# Altium schematic sheet DENAS_Scheme.SchDoc: Название платы
size 840 x 594 mm; ApprovedBy: Рогов; CheckedBy: Фамилия проверяющего; DrawnBy: Фамилия разработчика; DocumentNumber: Введите номер платы + Э3; SheetNumber: пусто если лист 1, иначе 1; SheetTotal: количество листов; Title1str: (вторая строка при необходимости); DocumentType: тип схемы; Format: A1; ImagePath: Введите номер платы
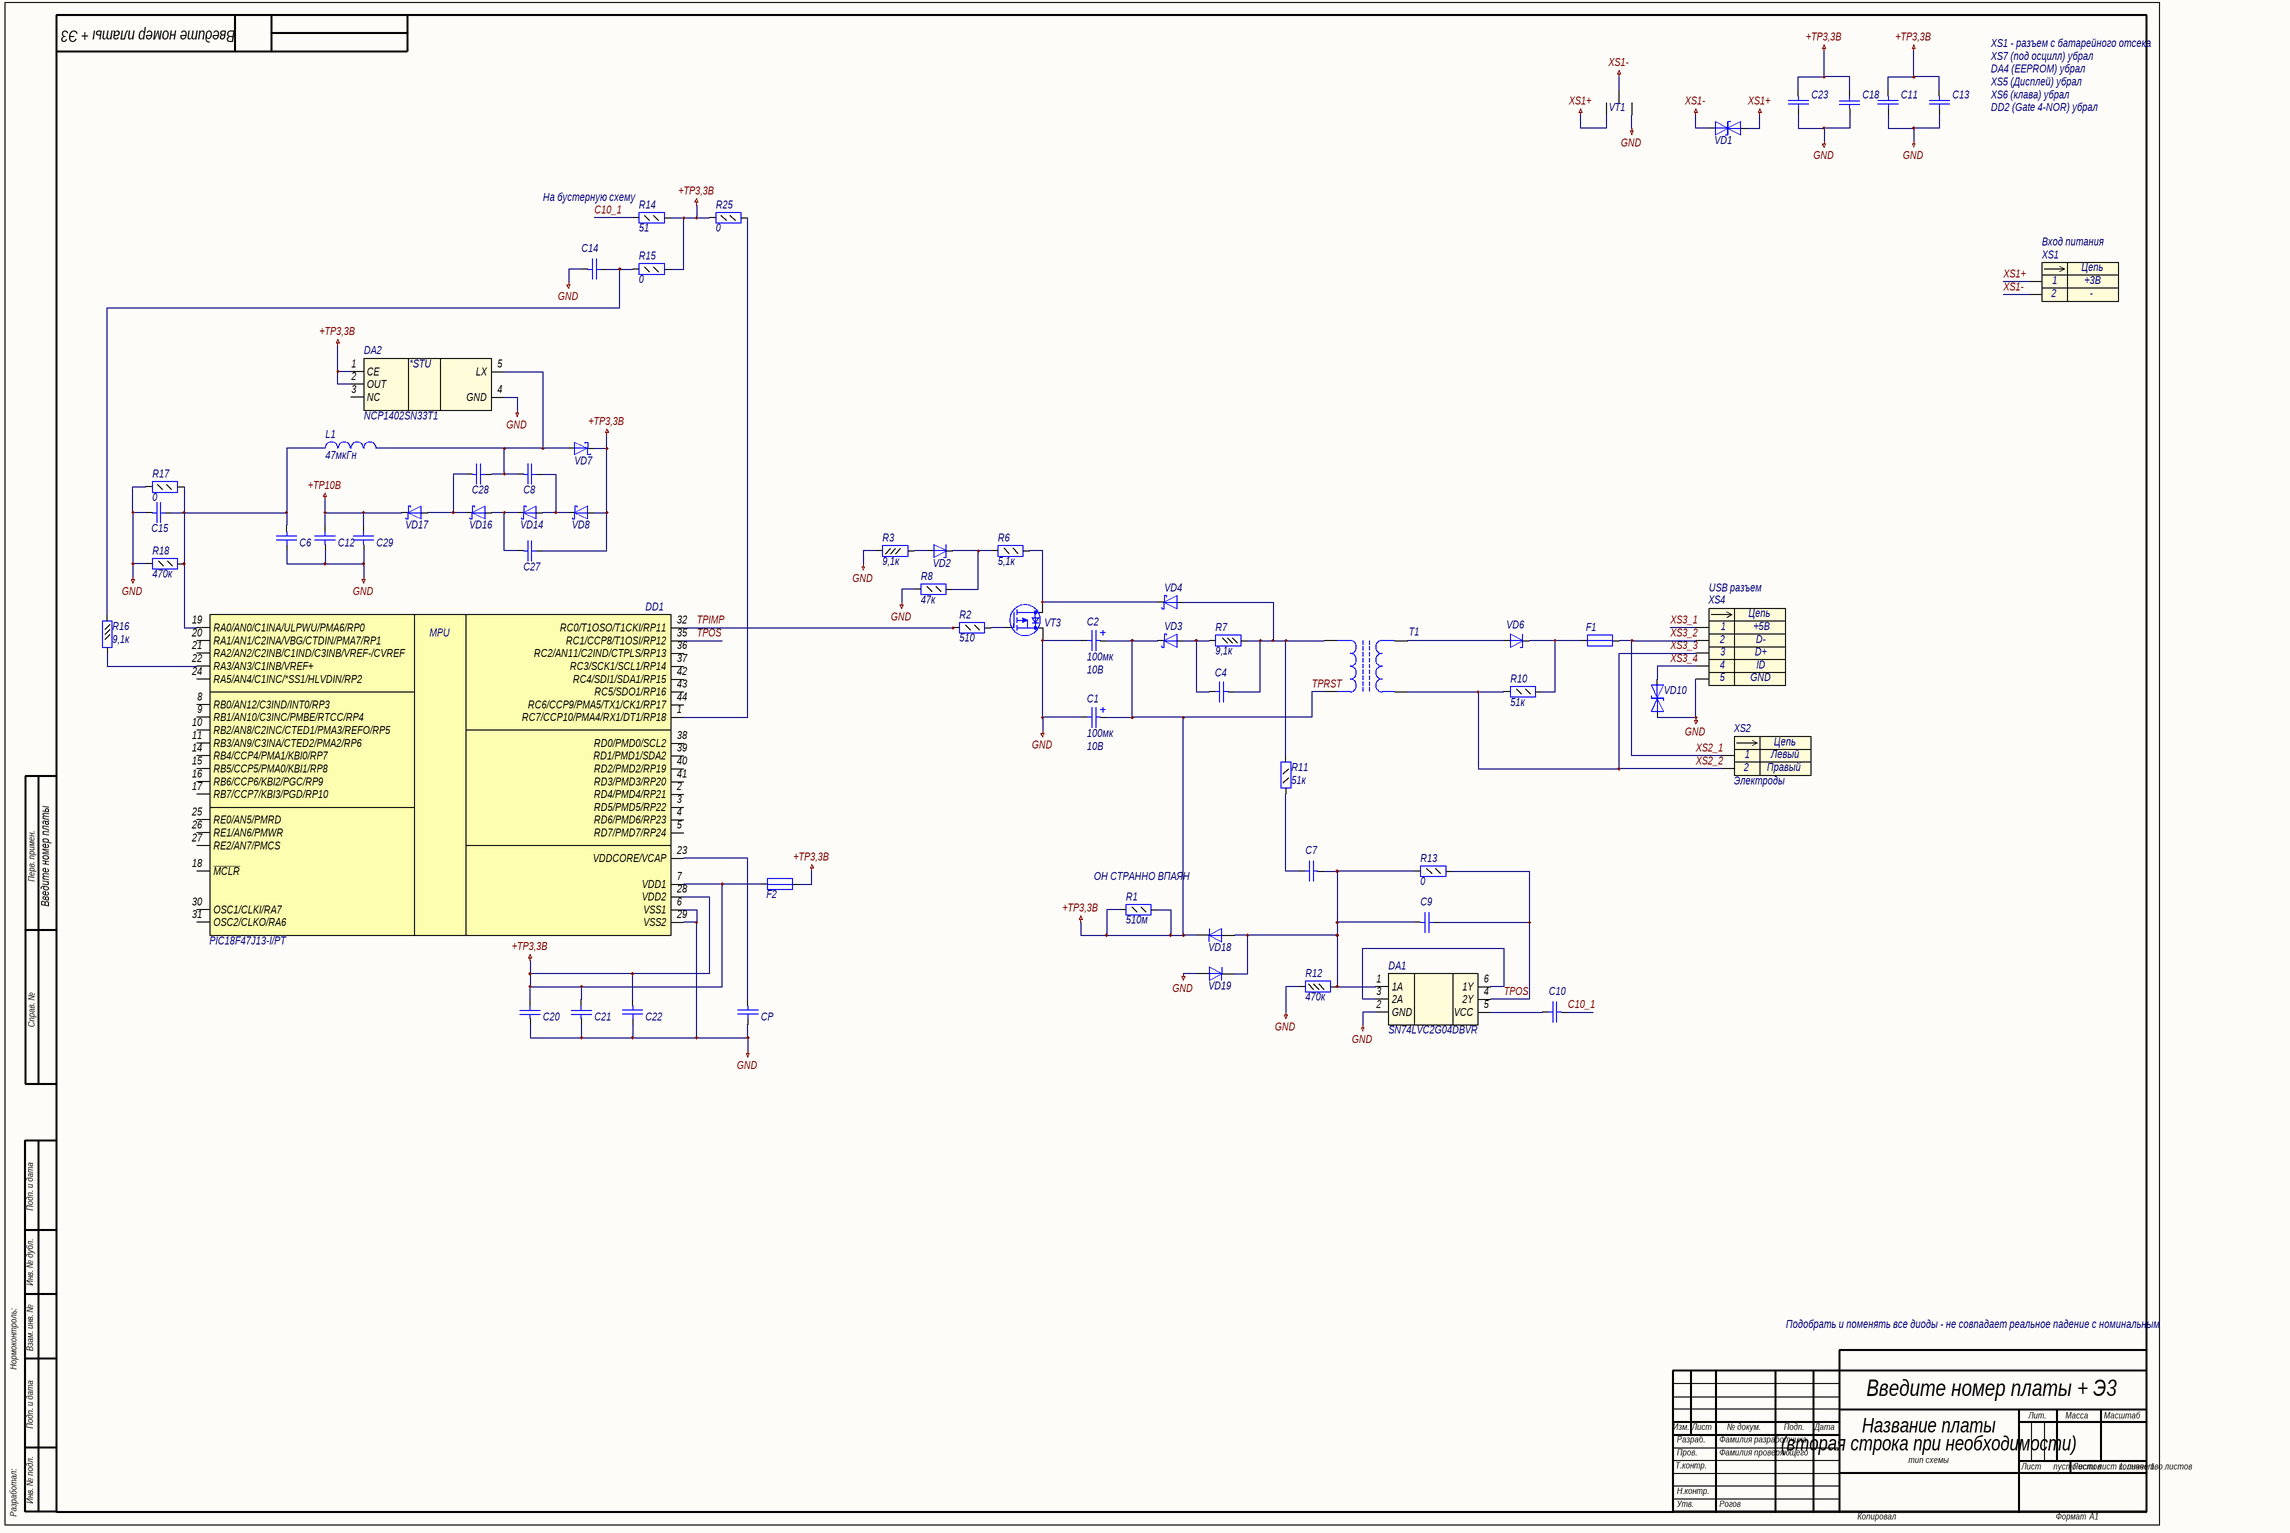
[diagram p0: DENAS_Scheme.SchDoc]

## Parts
C1  value 100мк  Voltage: 10В  [TANTAL CASE D]  (hidden comment: Capacitor_pol)
C2  value 100мк  Voltage: 10В  [TANTAL CASE D]  (hidden comment: Capacitor_pol)
C4  Capacitor  [C0402]  (value not drawn)
C6  Capacitor  [C0402]  (value not drawn)
C7  Capacitor  [C0402]  (value not drawn)
C8  Capacitor  [C0402]  (value not drawn)
C9  Capacitor  [C0402]  (value not drawn)
C10  Capacitor  [C0402]  (value not drawn)
C11  Capacitor  [C0402]  (value not drawn)
C12  Capacitor  [C0402]  (value not drawn)
C13  Capacitor  [C0402]  (value not drawn)
C14  Capacitor  [C0402]  (value not drawn)
C15  Capacitor  [C0402]  (value not drawn)
C18  Capacitor  [C0402]  (value not drawn)
C20  Capacitor  [C0402]  (value not drawn)
C21  Capacitor  [C0402]  (value not drawn)
C22  Capacitor  [C0402]  (value not drawn)
C23  Capacitor  [C0402]  (value not drawn)
C27  Capacitor  [C0402]  (value not drawn)
C28  Capacitor  [C0402]  (value not drawn)
C29  Capacitor  [C0402]  (value not drawn)
CP  Capacitor  [C0402]  (value not drawn)
DA1  SN74LVC2G04DBVR  [SOT23-6]
DA2  Part Number: NCP1402SN33T1  [SOT23-5]  (hidden comment: NCP1402)
DD1  PIC18F47J13-I/PT  [TQFP-44]
F1  Fuse  [FUSE812]  (value not drawn)
F2  Fuse  [FUSE812]  (value not drawn)
L1  value 47мкГн  [SDR0604]  (hidden comment: Inductor)
R1  value 510м  [R0805]  (hidden comment: Resistor_0,125Вт)
R2  value 510  [R0805]  (hidden comment: Resistor_0,125Вт)
R3  value 9,1к  [R0603]  (hidden comment: Resistor_0,062Вт)
R6  value 5,1к  [R0805]  (hidden comment: Resistor_0,125Вт)
R7  value 9,1к  [R0603]  (hidden comment: Resistor_0,062Вт)
R8  value 47к  [R0805]  (hidden comment: Resistor_0,125Вт)
R10  value 51к  [R0805]  (hidden comment: Resistor_0,125Вт)
R11  value 51к  [R0805]  (hidden comment: Resistor_0,125Вт)
R12  value 470к  [R0603]  (hidden comment: Resistor_0,062Вт)
R13  value 0  [R0805]  (hidden comment: Resistor_0,125Вт)
R14  value 51  [R0805]  (hidden comment: Resistor_0,125Вт)
R15  value 0  [R0805]  (hidden comment: Resistor_0,125Вт)
R16  value 9,1к  [R0603]  (hidden comment: Resistor_0,062Вт)
R17  value 0  [R0805]  (hidden comment: Resistor_0,125Вт)
R18  value 470к  [R0805]  (hidden comment: Resistor_0,125Вт)
R25  value 0  [R0805]  (hidden comment: Resistor_0,125Вт)
T1  Transformer  [Transformer36mm]  (value not drawn)
VD1  DiodeZenerDual  [SMB]  (value not drawn)
VD2  DiodeZener  [SOT23-3]  (value not drawn)
VD3  DiodeSchottky  [SOD-123]  (value not drawn)
VD4  DiodeSchottky  [SOD-123]  (value not drawn)
VD6  DiodeZener  [SOT23-3]  (value not drawn)
VD7  DiodeSchottky  [SOD-123]  (value not drawn)
VD8  DiodeSchottky  [SOD-123]  (value not drawn)
VD10  DiodeZenerDual  [SMB]  (value not drawn)
VD14  DiodeSchottky  [SOD-123]  (value not drawn)
VD16  DiodeSchottky  [SOD-123]  (value not drawn)
VD17  DiodeSchottky  [SOD-123]  (value not drawn)
VD18  Diode  [SOD-123]  (value not drawn)
VD19  Diode  [SOD-123]  (value not drawn)
VT3  P-MOSFET  [SOT23-3]  (value not drawn)
XS1  Вход питания  [CWF-2]
XS2  Электроды  [CWF-2]
XS4  USB разъем  [USB MINI AB RECEPTACLE]

## Nets
+TP10В: C12.2 C29.2 VD17.1(K)
GND: C1.2 C2.2 C6.2 C11.2 C12.1 C13.2 C14.1 C15.1 C18.1 C20.1 C21.1 C22.2 C23.2 C29.1 CP.2 DA1.2(GND) DA2.4(GND) DD1.6(VSS1) DD1.29(VSS2) R3.1 R8.2 R12.1 R17.1 R18.2 VD10.1(K) VD19.2(A) VT3.3(S) XS4.5
TPRST: C1.1 C2.1 C11.1 C13.1 C18.2 C20.2 C21.2 C22.1 C23.1 C27.2 DA2.1(CE) DA2.2(OUT) DD1.7(VDD1) DD1.28(VDD2) F2.1 F2.2 R1.1 R1.2 R14.2 R15.2 R25.1 T1.2 VD3.1(K) VD7.1(K) VD8.2(A) VD18.1(K)  [also labelled +TP3,3В]
XS1+: VD1.1(K) XS1.1
XS1-: VD1.2(A) XS1.2
C10_1: C10.1 R14.1
TPIMP: DD1.32(RC0/T1OSO/T1CKI/RP11) R2.2
TPOS: C9.2 DA1.4(2Y) DD1.35(RC1/CCP8/T1OSI/RP12) R13.1
XS2_1: F1.1 XS2.1 XS4.2  [also labelled XS3_2]
XS2_2: R10.2 T1.4 XS2.2 XS4.3  [also labelled XS3_3]
XS3_1: XS4.1
XS3_4: VD10.2(A) XS4.4
NetC4_1: C4.1 R7.1 R11.2 T1.1 VD4.2(A)
NetC4_2: C4.2 R7.2 VD3.2(A)
NetC6_1: C6.1 C15.2 DD1.19(RA0/AN0/C1INA/ULPWU/PMA6/RP0) L1.2 R17.2 R18.1
NetC7_1: C7.1 C9.1 DA1.1(1A) R12.2 R13.2 VD18.2(A) VD19.1(K)
NetC7_2: C7.2 R11.1
NetC8_1: C8.1 C28.2 DA2.5(LX) L1.1 VD7.2(A)
NetC8_2: C8.2 VD8.1(K) VD14.2(A)
NetC10_2: C10.2 DA1.5(VCC)
NetC14_2: C14.2 R15.1 R16.1
NetC27_1: C27.1 VD14.1(K) VD16.2(A)
NetC28_1: C28.1 VD16.1(K) VD17.2(A)
NetCP_1: CP.1 DD1.23(VDDCORE/VCAP)
NetDA1_3: DA1.3(2A) DA1.6(1Y)
NetDD1_1: DD1.1(RC7/CCP10/PMA4/RX1/DT1/RP18) R25.2
NetDD1_22: DD1.22(RA3/AN3/C1INB/VREF+) R16.2
NetF1_2: F1.2 R10.1 VD6.1(K)
NetR2_1: R2.1 VT3.1(G)
NetR3_2: R3.2 VD2.2(A)
NetR6_1: R6.1 VD4.1(K) VT3.2(D)
NetR6_2: R6.2 R8.1 VD2.1(K)
NetT1_3: T1.3 VD6.2(A)

Not connected (* = marked no-connect by the designer): DA2 3(NC); DD1 2(RD4/PMD4/RP21) 3(RD5/PMD5/RP22) 4(RD6/PMD6/RP23) 5(RD7/PMD7/RP24) 8(RB0/AN12/C3IND/INT0/RP3) 9(RB1/AN10/C3INC/PMBE/RTCC/RP4) 10(RB2/AN8/C2INC/CTED1/PMA3/REFO/RP5) 11(RB3/AN9/C3INA/CTED2/PMA2/RP6) 14(RB4/CCP4/PMA1/KBI0/RP7) 15(RB5/CCP5/PMA0/KBI1/RP8) 16(RB6/CCP6/KBI2/PGC/RP9) 17(RB7/CCP7/KBI3/PGD/RP10) 18(~{MCLR}) 20(RA1/AN1/C2INA/VBG/CTDIN/PMA7/RP1) 21(RA2/AN2/C2INB/C1IND/C3INB/VREF-/CVREF) 24(RA5/AN4/C1INC/*SS1/HLVDIN/RP2) 25(RE0/AN5/PMRD) 26(RE1/AN6/PMWR) 27(RE2/AN7/PMCS) 30(OSC1/CLKI/RA7) 31(OSC2/CLKO/RA6) 36(RC2/AN11/C2IND/CTPLS/RP13) 37(RC3/SCK1/SCL1/RP14) 38(RD0/PMD0/SCL2) 39(RD1/PMD1/SDA2) 40(RD2/PMD2/RP19) 41(RD3/PMD3/RP20) 42(RC4/SDI1/SDA1/RP15) 43(RC5/SDO1/RP16) 44(RC6/CCP9/PMA5/TX1/CK1/RP17)

## Notes on the sheet
- XS1 - разъем с батарейного отсека
- XS7 (под осцилл) убрал
- DA4 (EEPROM) убрал
- XS5 (Дисплей) убрал
- XS6 (клава) убрал
- VT1
- DD2 (Gate 4-NOR) убрал
- (near R14) На бустерную схему
- Перв. примен.
- (near R1) ОН СТРАННО ВПАЯН
- Справ. №
- Подп. и дата
- Инв. № дубл.
- Нормоконтроль:
- Взам. инв. №
- Подобрать и поменять все диоды - не совпадает реальное падение с номинальным
- Изм.
- Лист
- № докум.
- Подп.
- Дата
- Лит.
- Масса
- Масштаб
- Т.контр.
- Пров.
- Разраб.
- Листов
- Разработал:
- Инв. № подл.
- Н.контр.
- Утв.
- Копировал
- Формат
- (in symbol connect15) Цепь
- (in symbol connect48) Цепь; +5В
- (in symbol microcont9) MPU
- (in symbol pwr18) *STU

## Library data of the parts
C1 C2 = cap233: Конденсатор полярный; Part Name: Tantal; Manufacture: Kemet; Part Number: T495D107K010ATA080; id: cap233
C4 C6-C15 C18 C20-C23 C27-C29 CP = cap0: Конденсатор; Part Name: Ceramic; Manufacture: Murata; Part Number: GRP1555C1HR47CZ01E; Voltage: 50B; id: cap0; TKE: NP0; Value: ?
DA1 = logic12: Инвертирующий Триггер Шмитта; Part Name: Schmitt trigger inverter CMOS; Manufacture: Texas Instruments; Type of Logic: NO; Number of elements: 2; Logic High Level: 1,7-2B; Logic Low Level: 0,7-0,8В; Power Supply: 1,65В-5,5B; id: logic12; Part Number: SN74LVC2G04DBVR
DA2 = pwr18: Step-up DC-DC Converter for 2-V to 3.3-V; Part Name: Step−up DC−DC Converter; Manufacturer: ON Semiconductor; id: pwr18; Input Voltage: 2В; Output Voltage: 3,3В; Current: 200mA; Type: Linear
DD1 = microcont9: Микроконтроллер 8-Бит, 44-pin; Part Name: Microcontroller; Frequency: 48MHz; ADC: 13x12b; Interface: spi, i2c, euart, rs-485, rs-232, lin/j2602,; Flash: 128kb; Pin in: 25; Power Supply: 2,0-3,6В; id: microcont9; Part Number: PIC18F47J13-I/PT
F1 = fuse8: Предохранитель; Part Name: Resettable Fuses; Manufacture: Bourns; Part Number: MF-MSMF050; id: fuse8; V max: 15B; I max: 100A; I hold: 0,5A; I trip: 1A; Resistance: 0,15Ohms
F2 = fuse0: Предохранитель; Part Name: Resettable Fuses; Manufacture: Bourns; Part Number: MF-MSMF075; id: fuse0; V max: 13,2B; I max: 100A; I hold: 0,75A; I trip: 1,5A; Resistance: 0,45Ohms
L1 = ind50: EMI Suppression Filter; Part Name: SMD Power Inductors; Part Number: SDR0604- 470KL; Manufacture: Bourns; Rated Current: 0,72A; id: ind50; Saturation Current: 1,0A; Resistance: 0,37Ohm
R1 R2 = res66: Резистор; Manufacture: Yageo; Part Number: RC0805FR-07510RL; id: res66; Accuracy: 0.01; Part Name: Resistor; Power: 0,125Вт
R3 R7 R16 = res482: Резистор; Manufacture: Yageo; Part Number: RC0603FR-079K1; id: res482; Accuracy: 1%; Part Name: Resistor; Power: 0,062Вт
R6 = res90: Резистор; Manufacture: Yageo; Part Number: RC0805FR-075K1; id: res90; Accuracy: 0.01; Part Name: Resistor; Power: 0,125Вт
R8 = res113: Резистор; Manufacture: Yageo; Part Number: RC0805FR-0747KL; id: res113; Accuracy: 0.01; Part Name: Resistor; Power: 0,125Вт
R10 R11 = res114: Резистор; Manufacture: Yageo; Part Number: RC0805FR-0751KL; id: res114; Accuracy: 0.01; Part Name: Resistor; Power: 0,125Вт
R12 = res523: Резистор; Manufacture: Yageo; Part Number: RC0603FR-07470KL; id: res523; Accuracy: 1%; Part Name: Resistor; Power: 0,062Вт
R13 R15 R17 R25 = res0: Резистор; Manufacture: Yageo; Part Number: RC0805FR-070RL; id: res0; Accuracy: 1%; Part Name: Resistor; Power: 0,125Вт
R14 = res42: Резистор; Manufacture: Yageo; Part Number: RC0805FR-0751RL; id: res42; Accuracy: 0.01; Part Name: Resistor; Power: 0,125Вт
R18 = res137: Резистор; Manufacture: Yageo; Part Number: RC0805FR-07470KL; id: res137; Accuracy: 0.01; Part Name: Resistor; Power: 0,125Вт
T1 = ind3: EMI Suppression Filter; Part Name: transformer cup; id: ind3
VD1 VD10 = SMBJ8.5CA: Cтабилитрон (диод выпрямительный лавинный) двусторонний; Part Name: TVS diode Bidirectional; Manufacture: ST Microelectronics; id: tvs43; Leakage Current: 0,2uA; Stand-off Voltage: 8,5B; Breakdown Voltage: 9,9B; Clamping voltage: 14,4B; Dynamic resistance: 0,096Ohm; Peak Pulse Power: 600W; Number of diodes: 1; Part Number: SMBJ8.5CA
VD2 = diode18: Cтабилитрон (лавинный выпрямительный диод) односторонний; Part Number: BZX84-C30; Manufacture: Nexperia; Max Reverse Voltage: 32В; Forward Voltage: 0,6B; Forward Current: 10mA; Breakdown Current: 2mA; Capacitance: 50pF; Number of Channels: 1; id: diode18; Part Name: Diode Zener; Breakdown Voltage: 32В
VD3 VD4 = diode15: Диод Шоттки; Part Number: MBR0540; Manufacture: ON Semiconductor; Max Reverse Voltage: 40B; Forward Voltage: 0,62B; Forward Current: 0,5А; Capacitance: 30pF; Number of Channels: 1; id: diode15; Part Name: Diode Schottky
VD6 = diode17: Cтабилитрон (лавинный выпрямительный диод) односторонний; Part Number: BZX84-C5V1; Manufacture: Nexperia; Max Reverse Voltage: 5,4B; Forward Voltage: 0,6B; Forward Current: 10mA; Breakdown Current: 5mA; Capacitance: 300pF; Number of Channels: 1; id: diode17; Part Name: Diode Zener; Breakdown Voltage: 5,4B
VD7 VD8 VD14 VD16 VD17 = diode16: Диод Шоттки; Part Number: MBR0520LT1; Manufacture: ON Semiconductor; Max Reverse Voltage: 20B; Forward Voltage: 0,385B; Forward Current: 0,5А; Breakdown Current: 5,5А; Capacitance: 10pF; Number of Channels: 1; id: diode16; Part Name: Diode Schottky
VD18 VD19 = diode20: Диод; Part Number: MMSD4148; Manufacture: ON Semiconductor; Max Reverse Voltage: 100B; Forward Voltage: 1B; Forward Current: 10mA; Breakdown Current: 100uA; Reverse Recovery time: 4ns; Capacitance: 4pF; Number of Channels: 1; id: diode20; Part Name: Diode; Breakdown Voltage: 100B
VT3 = trans5: N-MOSFET; Part Number: IRLML2244TRPbF; Manufacturer: International Rectifier; id: trans5; Structure: p-channel; V drain-source max: (-20B); Rds: 0,054Ohm; Gate-to-source voltage: (+-)12B; Continuous drain current: (-4,3)A; Pulsed drain current: (-18)A; Power dissipation: 1,3W
XS1 = connect15: Разъем - 2 конт. вилка; Part Number: DS1069-2MVW6X; Manufacture: Ningbo connfly electronic; Contact_1: +3В; Etch: 2,5mm; Contact_2: -; Name: Вход питания; Part Name: CWF-2; id: connect15
XS2 = connect15: Разъем - 2 конт. вилка; Part Number: DS1069-2MVW6X; Manufacture: Ningbo connfly electronic; Contact_1: Левый; Contact_2: Правый; Etch: 2,5mm; Name: Электроды; Part Name: CWF-2; id: connect15
XS4 = connect48: USB Mini Type AB Receptacle; Part Name: Mini-USB AB Receptacle; Part Number: UJ2-MABH-1-SMT-TR; Manufacture: CUI; Contact_1: VCC; Contact_2: D-; Contact_3: D+; Contact_4: ID; Contact_5: GND; id: connect48